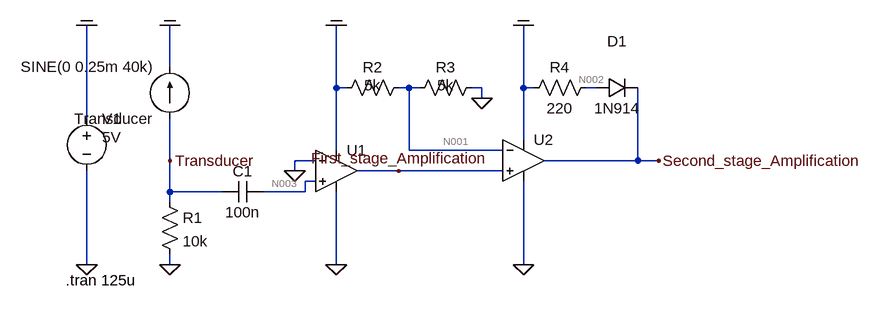
[diagram p0: schematic Receiver Circuit.asc]
Receiver Circuit.asc, the LTspice schematic file:
Version 4
SHEET 1 892 680
WIRE -208 0 -208 -64
WIRE 48 32 48 -64
WIRE 64 32 48 32
WIRE 160 32 144 32
WIRE 176 32 160 32
WIRE 272 32 256 32
WIRE 336 32 336 -64
WIRE 352 32 336 32
WIRE 448 32 432 32
WIRE 272 48 272 32
WIRE -336 80 -336 -64
WIRE 336 112 336 32
WIRE 48 128 48 32
WIRE 160 128 160 32
WIRE 304 128 160 128
WIRE -208 144 -208 80
WIRE 16 144 -16 144
WIRE 512 144 512 32
WIRE 512 144 368 144
WIRE 544 144 512 144
WIRE -16 160 -16 144
WIRE 144 160 80 160
WIRE 304 160 144 160
WIRE 16 176 0 176
WIRE -208 192 -208 144
WIRE -128 192 -208 192
WIRE 0 192 0 176
WIRE 0 192 -64 192
WIRE -208 208 -208 192
WIRE -336 304 -336 160
WIRE -208 304 -208 288
WIRE 48 304 48 192
WIRE 336 304 336 176
FLAG 48 -64 COM
FLAG 336 -64 COM
FLAG -208 -64 COM
FLAG -208 304 0
FLAG 48 304 0
FLAG 336 304 0
FLAG -16 160 0
FLAG 272 48 0
FLAG -336 -64 COM
FLAG -336 304 0
FLAG -208 144 Transducer
FLAG 144 160 First_stage_Amplification
FLAG 544 144 Second_stage_Amplification
SYMBOL cap -64 176 R90
WINDOW 0 0 32 VBottom 2
WINDOW 3 32 32 VTop 2
SYMATTR InstName C1
SYMATTR Value 100n
SYMBOL res -224 192 R0
SYMATTR InstName R1
SYMATTR Value 10k
SYMBOL res 160 16 R90
WINDOW 0 0 56 VBottom 2
WINDOW 3 28 56 VBottom 2
SYMATTR InstName R2
SYMATTR Value 5k
SYMBOL res 272 16 R90
WINDOW 0 0 56 VBottom 2
WINDOW 3 28 56 VBottom 2
SYMATTR InstName R3
SYMATTR Value 5k
SYMBOL res 448 16 R90
WINDOW 0 0 56 VBottom 2
WINDOW 3 32 56 VTop 2
SYMATTR InstName R4
SYMATTR Value 220
SYMBOL diode 448 48 R270
WINDOW 0 72 32 VTop 2
WINDOW 3 0 32 VBottom 2
SYMATTR InstName D1
SYMATTR Value 1N914
SYMATTR Description Light Emitting Diode
SYMATTR Type led
SYMBOL voltage -336 64 R0
WINDOW 3 24 44 Left 2
WINDOW 123 0 0 Left 0
WINDOW 39 0 0 Left 0
SYMATTR Value 5V
SYMATTR InstName V1
SYMBOL current -208 80 R180
WINDOW 123 0 0 Left 0
WINDOW 39 0 0 Left 0
SYMATTR InstName Transducer
SYMATTR Value SINE(0 0.25m 40k)
SYMBOL Opamps\\UniversalOpamp2 48 160 R0
SYMATTR InstName U1
SYMBOL Opamps\\UniversalOpamp2 336 144 R0
SYMATTR InstName U2
TEXT -368 328 Left 2 !.tran 125u

The netlist it stands for:
* Receiver Circuit.asc
C1 N003 Transducer 100n
R1 Transducer 0 10k
R2 N001 COM 5k
R3 0 N001 5k
R4 N002 COM 220
D1 N002 Second_stage_Amplification 1N914
V1 COM 0 5V
I§Transducer Transducer COM SINE(0 0.25m 40k)
XU1 N003 0 COM 0 First_stage_Amplification level.2 Avol=1Meg GBW=10Meg Slew=10Meg ilimit=25m rail=0 Vos=0 phimargin=45 en=0 enk=0 in=0 ink=0 Rin=500Meg  ; pins IN+ IN- V+ V- OUT
XU2 First_stage_Amplification N001 COM 0 Second_stage_Amplification level.2 Avol=1Meg GBW=10Meg Slew=10Meg ilimit=25m rail=0 Vos=0 phimargin=45 en=0 enk=0 in=0 ink=0 Rin=500Meg  ; pins IN+ IN- V+ V- OUT
.model D D
.lib standard.dio
.tran 125u
.lib UniversalOpamps2.sub
.backanno
.end

* Results of the author's LTspice run, read from the files saved beside the schematic
* Operating Point, zero values left out:
*   V(n003) = 2.172 V
*   V(transducer) = 6.559 µV
*   V(n001) = 2.5 V
*   V(com) = 5 V
*   V(n002) = 5 V
*   V(second_stage_amplification) = 5 V
*   V(first_stage_amplification) = 5 V
*   I(C1) = 655.9 pA
*   I(R3) = -500 µA
*   I(R2) = -500 µA
*   I(R1) = 655.9 pA
*   I(V1) = -501.1 µA
*   Ix(u1:1) = -655.9 pA
*   Ix(u1:2) = -5 nA
*   Ix(u1:3) = 533.8 nA
*   Ix(u1:4) = -598.1 nA
*   Ix(u1:5) = -5 nA
*   Ix(u2:1) = 5 nA
*   Ix(u2:3) = 523.5 nA
*   Ix(u2:4) = -603.5 nA
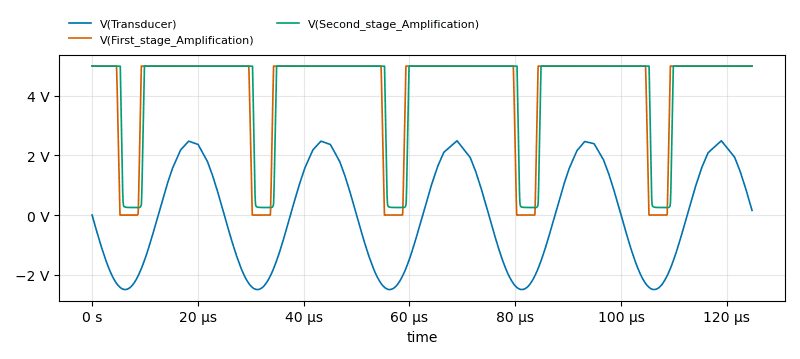
[diagram p1: Transient Analysis of Receiver Circuit.asc, plotted from the saved traces]
* Transient Analysis, 1 run:
*   V(Transducer): min -2.499 V, max 2.494 V, average -12.49 mV, rms 1.759 V, last 158.5 mV
*   V(First_stage_Amplification): min 6.094 µV, max 5 V, average 4.186 V, rms 4.554 V, last 5 V
*   V(Second_stage_Amplification): min 253.1 mV, max 5 V, average 4.233 V, rms 4.562 V, last 5 V